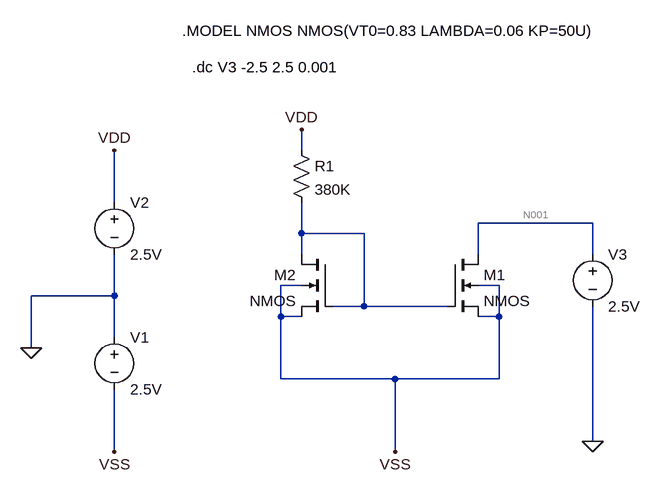
[diagram p0: schematic Current_Sink_10uA.asc]
Current_Sink_10uA.asc, the LTspice schematic file:
Version 4
SHEET 1 1412 680
WIRE 96 -64 96 -96
WIRE -192 16 -192 -64
WIRE 544 48 368 48
WIRE 96 64 96 16
WIRE 192 64 96 64
WIRE 96 96 96 64
WIRE 368 96 368 48
WIRE 544 96 544 48
WIRE 96 144 64 144
WIRE 400 144 368 144
WIRE -192 160 -192 96
WIRE -192 160 -320 160
WIRE 192 176 192 64
WIRE 192 176 144 176
WIRE 320 176 192 176
WIRE 64 192 64 144
WIRE 96 192 64 192
WIRE 400 192 400 144
WIRE 400 192 368 192
WIRE -192 224 -192 160
WIRE -320 240 -320 160
WIRE 64 288 64 192
WIRE 240 288 64 288
WIRE 400 288 400 192
WIRE 400 288 240 288
WIRE 544 384 544 176
WIRE -192 400 -192 304
WIRE 240 400 240 288
FLAG -320 240 0
FLAG 544 384 0
FLAG -192 -64 VDD
FLAG -192 400 VSS
FLAG 96 -96 VDD
FLAG 240 400 VSS
SYMBOL nmos4 320 96 R0
SYMATTR InstName M1
SYMATTR Value2 l=5 w=15
SYMBOL nmos4 144 96 M0
SYMATTR InstName M2
SYMATTR Value2 l=5 w=15
SYMBOL voltage -192 208 R0
WINDOW 123 0 0 Left 2
WINDOW 39 0 0 Left 2
SYMATTR InstName V1
SYMATTR Value 2.5V
SYMBOL voltage -192 0 R0
WINDOW 123 0 0 Left 2
WINDOW 39 0 0 Left 2
SYMATTR InstName V2
SYMATTR Value 2.5V
SYMBOL voltage 544 80 R0
WINDOW 123 0 0 Left 2
WINDOW 39 0 0 Left 2
SYMATTR InstName V3
SYMATTR Value 2.5V
SYMBOL res 80 -80 R0
SYMATTR InstName R1
SYMATTR Value 380K
TEXT -88 -248 Left 2 !.MODEL NMOS NMOS(VT0=0.83 LAMBDA=0.06 KP=50U)
TEXT -72 -192 Left 2 !.dc V3 -2.5 2.5 0.001

The netlist it stands for:
* Current_Sink_10uA.asc
M1 N001 N002 VSS VSS NMOS l=5 w=15
M2 N002 N002 VSS VSS NMOS l=5 w=15
V1 0 VSS 2.5V
V2 VDD 0 2.5V
V3 N001 0 2.5V
R1 VDD N002 380K
.model NMOS NMOS
.model PMOS PMOS
.lib standard.mos
.MODEL NMOS NMOS(VT0=0.83 LAMBDA=0.06 KP=50U)
.dc V3 -2.5 2.5 0.001
.backanno
.end

* Results of the author's LTspice run, read from the files saved beside the schematic
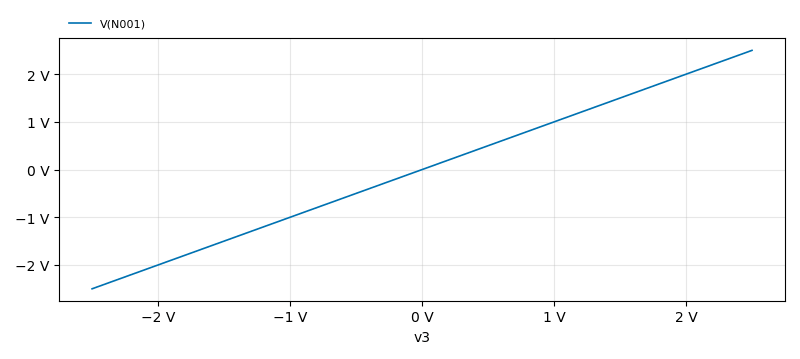
[diagram p1: DC transfer characteristic of Current_Sink_10uA.asc, plotted from the saved traces]
* DC transfer characteristic, 1 run:
*   V(N001): -2.5 V at v3=-2.5 V, 2.5 V at v3=2.5 V, min -2.5 V, max 2.5 V